# EAGLE design SK_1.0v (EAGLE 7.5.0)
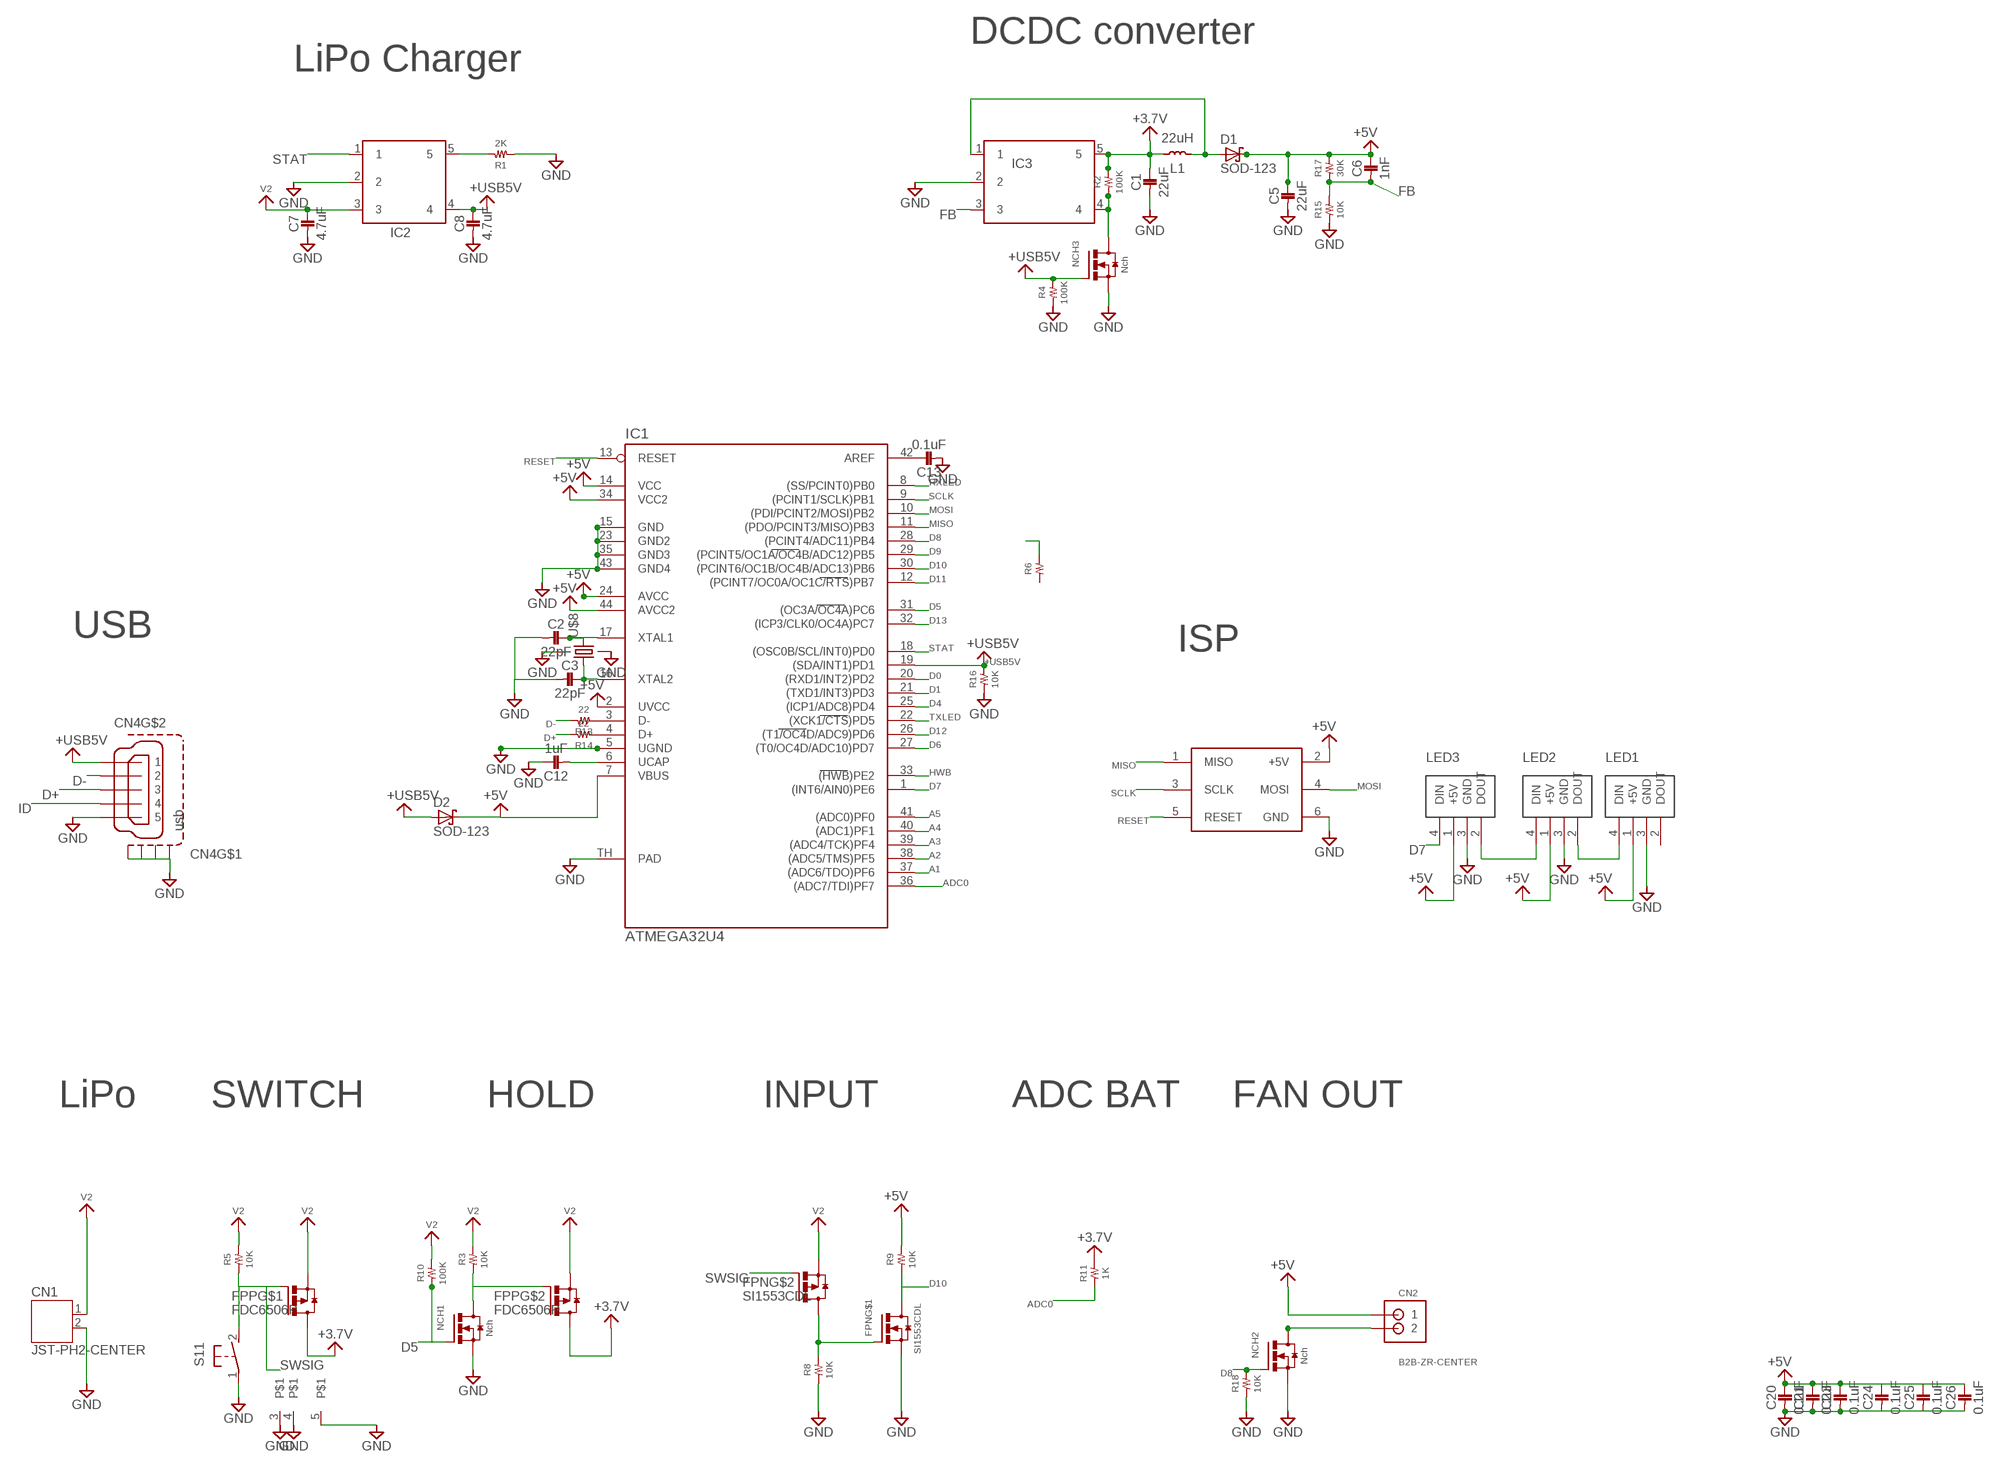
[diagram p0: schematic, sheet 1]

## Parts
C1  22uF  1608  [1608]
C2  22pF  1005  [1005]
C3  22pF  1005  [1005]
C5  22uF  1608  [1608]
C6  1nF  1005  [1005]
C7  4.7uF  1005  [1005]
C8  4.7uF  1005  [1005]
C12  1uF  1005  [1005]
C13  0.1uF  1005  [1005]
C20  0.1uF  1608  [1608]
C21  0.1uF  1608  [1608]
C23  0.1uF  1608  [1608]
C24  0.1uF  1005  [1005]
C25  0.1uF  1005  [1005]
C26  0.1uF  1005  [1005]
CN1  JST-PH2-CENTER  [JST-PH2-CENTER]
CN2  B2B-ZR-CENTER  [B2B-ZR-CENTER]
CN4  usb  MICRO-USB-SHIELD-ZX62R-B-5P  [ZX62R-B-5P]
D1  SOD-123  [SOD_123]
D2  SOD-123  [SOD_123]
FPN  SI1553CDL  [SOT363]
FPP  FDC6506P  [SOT23-6]
IC1  ATMEGA32U4  [QFN-44-7X7]
IC2  MCP73831  [SOT23-5L]
IC3  LM2735  [SOT23-5L]
L1  22uH  D63  [TOKO]
LED1  NEO_FLAT  [NEO_FLAT]
LED2  NEO_FLAT  [NEO_FLAT]
LED3  NEO_FLAT  [NEO_FLAT]
NCH1  Nch  CHIP_FET  [SOT23]
NCH2  Nch  CHIP_FET  [SOT23]
NCH3  Nch  CHIP_FET  [SOT23]
R1  2K  RESISTOR_1005  [1005]
R2  100K  RESISTOR_1005  [1005]
R3  10K  RESISTOR_1005  [1005]
R4  100K  RESISTOR_1005  [1005]
R5  10K  RESISTOR_1005  [1005]
R6  RESISTOR__SMD  [1608]
R8  10K  RESISTOR_1005  [1005]
R9  10K  RESISTOR_1005  [1005]
R10  100K  RESISTOR_1005  [1005]
R11  1K  RESISTOR_1005  [1005]
R13  22  RESISTOR_1005  [1005]
R14  22  RESISTOR_1005  [1005]
R15  10K  RESISTOR_1005  [1005]
R16  10K  RESISTOR_1005  [1005]
R17  30K  RESISTOR_1005  [1005]
R18  10K  RESISTOR_1005  [1005]
S1  31-XX  [B3F-31XX]
U$3  ICSP  [ICSP]
U$8  FA-238  [FA-238]

## Nets
+3.7V: C1.P$1 FPP.4(D) FPP.6(D) IC3.5 L1.1 R2.2 R11.2
+5V: C5.P$1 C6.1 C20.P$1 C21.P$1 C23.P$1 C24.1 C25.1 C26.1 CN2.1 D1.C D2.C IC1.2(UVCC) IC1.7(VBUS) IC1.14(VCC) IC1.24(AVCC) IC1.34(VCC2) IC1.44(AVCC2) LED1.1(+5V) LED2.1(+5V) LED3.1(+5V) R9.2 R17.2 U$3.2(+5V)
+USB5V: C8.1 CN4.1 D2.A IC1.19((SDA/INT1)PD1) IC2.4 NCH3.1(G) R4.2 R16.2
A1: IC1.37((ADC6/TDO)PF6)
A2: IC1.38((ADC5/TMS)PF5)
A3: IC1.39((ADC4/TCK)PF4)
A4: IC1.40((ADC1)PF1)
A5: IC1.41((ADC0)PF0)
ADC0: IC1.36((ADC7/TDI)PF7) R11.1
D0: IC1.20((RXD1/INT2)PD2)
D1: IC1.21((TXD1/INT3)PD3)
D4: IC1.25((ICP1/ADC8)PD4)
D5: IC1.31((OC3A/OC4A)PC6) NCH1.1(G) R10.1
D6: IC1.27((T0/OC4D/ADC10)PD7)
D7: IC1.1((INT6/AIN0)PE6) LED3.4(DIN)
D8: IC1.28((PCINT4/ADC11)PB4) NCH2.1(G) R18.2
D9: IC1.29((PCINT5/OC1A/OC4B/ADC12)PB5) R6.2
D10: FPN.6(D) IC1.30((PCINT6/OC1B/OC4B/ADC13)PB6) R9.1
D11: IC1.12((PCINT7/OC0A/OC1C/RTS)PB7)
D12: IC1.26((T1/OC4D/ADC9)PD6)
D13: IC1.32((ICP3/CLK0/OC4A)PC7)
D+: CN4.3 R14.2
D-: CN4.2 R13.2
DL: D1.A IC3.1 L1.2
FB: C6.2 IC3.3 R15.2 R17.1
GND: C1.P$2 C2.2 C3.2 C5.P$2 C7.2 C8.2 C12.1 C13.2 C20.P$2 C21.P$2 C23.P$2 C24.2 C25.2 C26.2 CN1.2 CN4.5 CN4.M1(S1) CN4.M2(S2) CN4.M3(S3) CN4.M4(S4) FPN.1(S) IC1.5(UGND) IC1.15(GND) IC1.23(GND2) IC1.35(GND3) IC1.43(GND4) IC1.TH(PAD) IC2.2 IC3.2 LED1.3(GND) LED2.3(GND) LED3.3(GND) NCH1.2(S) NCH2.2(S) NCH3.2(S) R1.1 R4.1 R8.1 R15.1 R16.1 R18.1 S1.1(1:P) S1.3 S1.4 S1.5 U$3.6(GND) U$8.2 U$8.4
HWB: IC1.33((HWB)PE2)
ID: CN4.4
MISO: IC1.11((PDO/PCINT3/MISO)PB3) U$3.1(MISO)
MOSI: IC1.10((PDI/PCINT2/MOSI)PB2) U$3.4(MOSI)
N$1: CN2.2 NCH2.3(D)
N$2: IC2.5 R1.2
N$3: IC3.4 NCH3.3(D) R2.1
N$6: FPP.3(G) NCH1.3(D) R3.1
N$7: C3.1 IC1.16(XTAL2) U$8.1
N$8: IC1.3(D-) R13.1
N$9: C13.1 IC1.42(AREF)
N$10: C2.1 IC1.17(XTAL1) U$8.3
N$14: IC1.4(D+) R14.1
N$18: C12.2 IC1.6(UCAP)
RESET: IC1.13(RESET) U$3.5(RESET)
RXLED: IC1.8((SS/PCINT0)PB0)
SCLK: IC1.9((PCINT1/SCLK)PB1) U$3.3(SCLK)
SIG: FPN.2(G) FPN.3(D) R8.2
SIG1: LED2.4(DIN) LED3.2(DOUT)
SIG2: LED1.4(DIN) LED2.2(DOUT)
STAT: IC1.18((OSC0B/SCL/INT0)PD0) IC2.1
SWSIG: FPN.5(G) FPP.1(G) R5.1 S1.2(1:S)
TXLED: IC1.22((XCK1/CTS)PD5)
V2 [POWER]: C7.1 CN1.1 FPN.4(S) FPP.2(S) FPP.5(S) IC2.3 R3.2 R5.2 R10.2
Unconnected: LED1.2(DOUT) R6.1

## Notes on the sheet
- DCDC converter
- LiPo Charger
- USB
- ISP
- LiPo | SWITCH | HOLD | INPUT | ADC BAT | FAN OUT

## Library data of the parts
C1 C5 C20 C21 C23 = 02_C:1608
C2 C3 C6-C8 C12 C13 C24-C26 = 02_C:1005
CN1 = jst-ph (1):JST-PH2-CENTER
CN2 = jst:B2B-ZR-CENTER
CN4 = con-hirose1:MICRO-USB-SHIELD-: Hirose Micro USB Connector ZX62R-B-5P: Micro B, reverse (top mount) shell SMT Supplier: DigiKey H11574CT-ND Source: http://www.hirose.co.jp/cataloge_hp/e24200011.pdf
D1 D2 = 15_DIODE:SOD-123
FPN = 06_FET:SI1553CDL
FPP = 06_FET:FDC6506P
IC1 = 04_IC:ATMEGA32U4
IC2 = 04_IC:MCP73831
IC3 = 04_IC:LM2735
L1 = 03_L:D63
LED1-LED3 = 10_LED:NEO_FLAT
NCH1-NCH3 = 06_FET:CHIP_FET
R1-R5 R8-R11 R13-R18 = 01_R:RESISTOR_1005
R6 = 01_R:RESISTOR__SMD
S1 = 09_1_switch:31-XX: OMRON SWITCH
U$3 = 08_CONECTOR:ICSP
U$8 = 09_2_CRYSTAL:FA-238

## Board
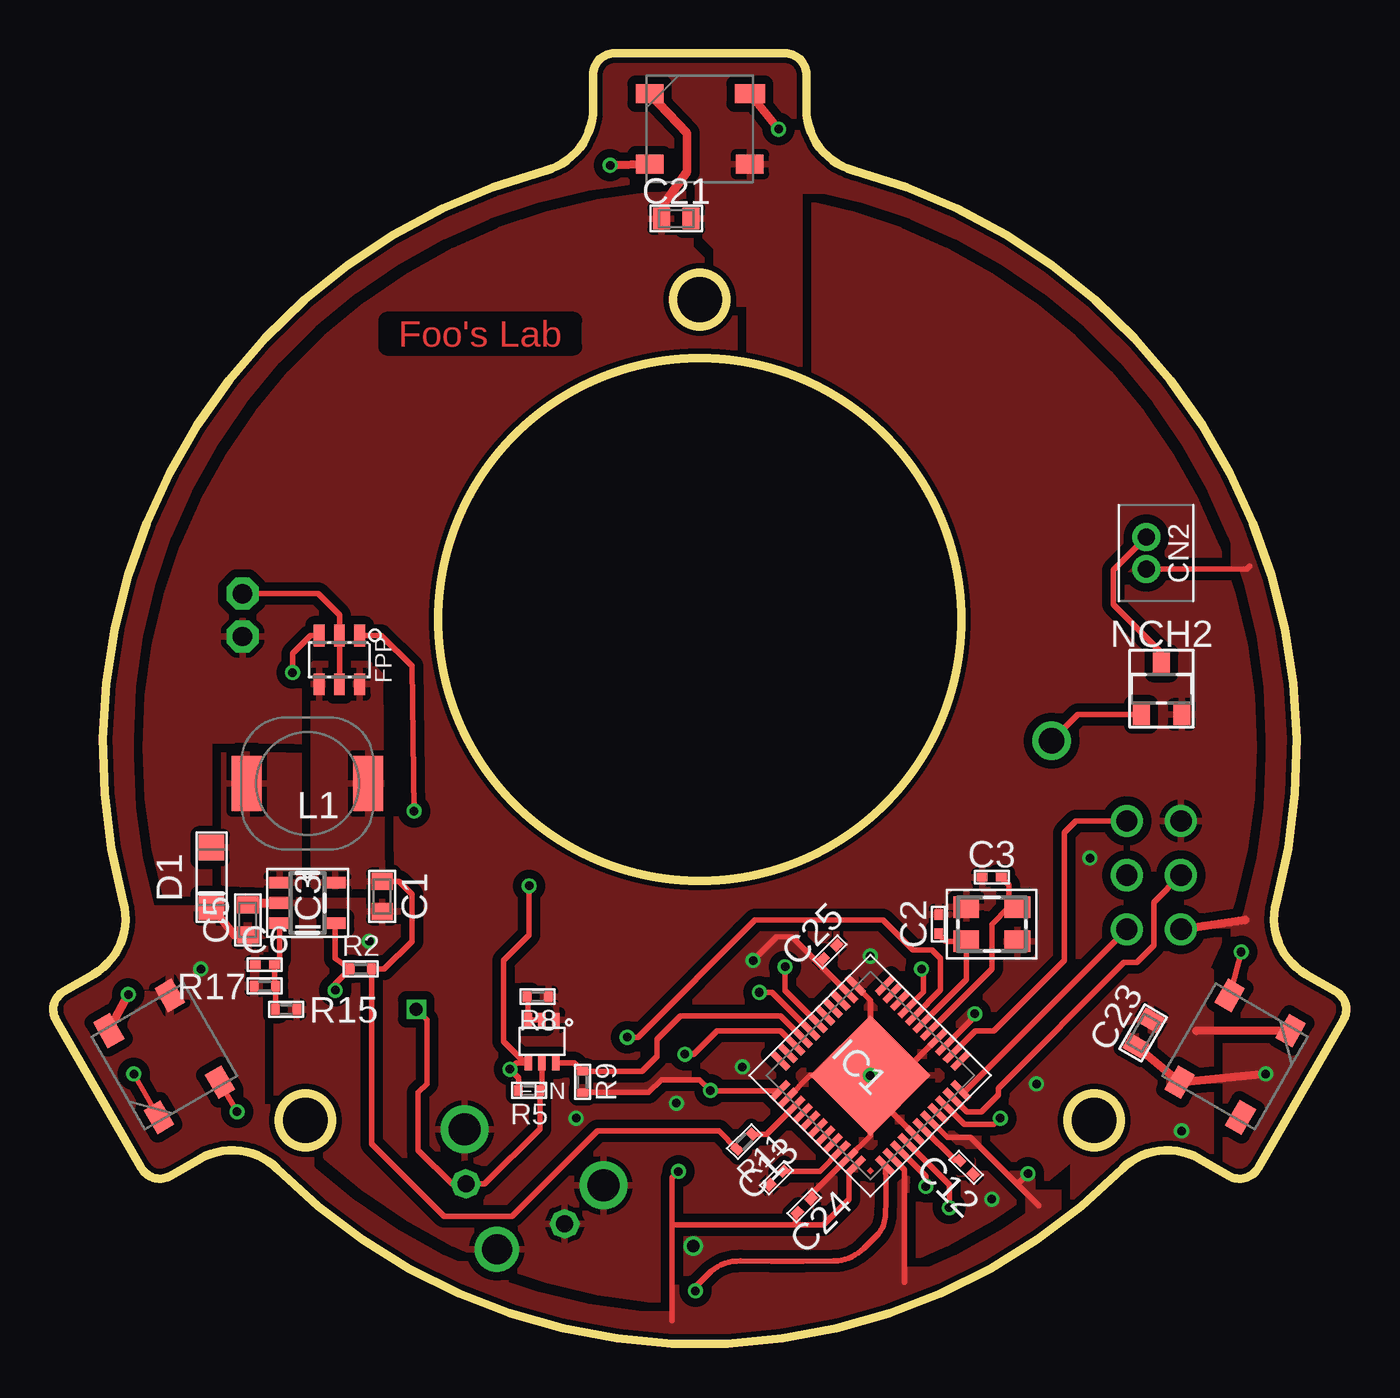
[diagram p1: board, top side]
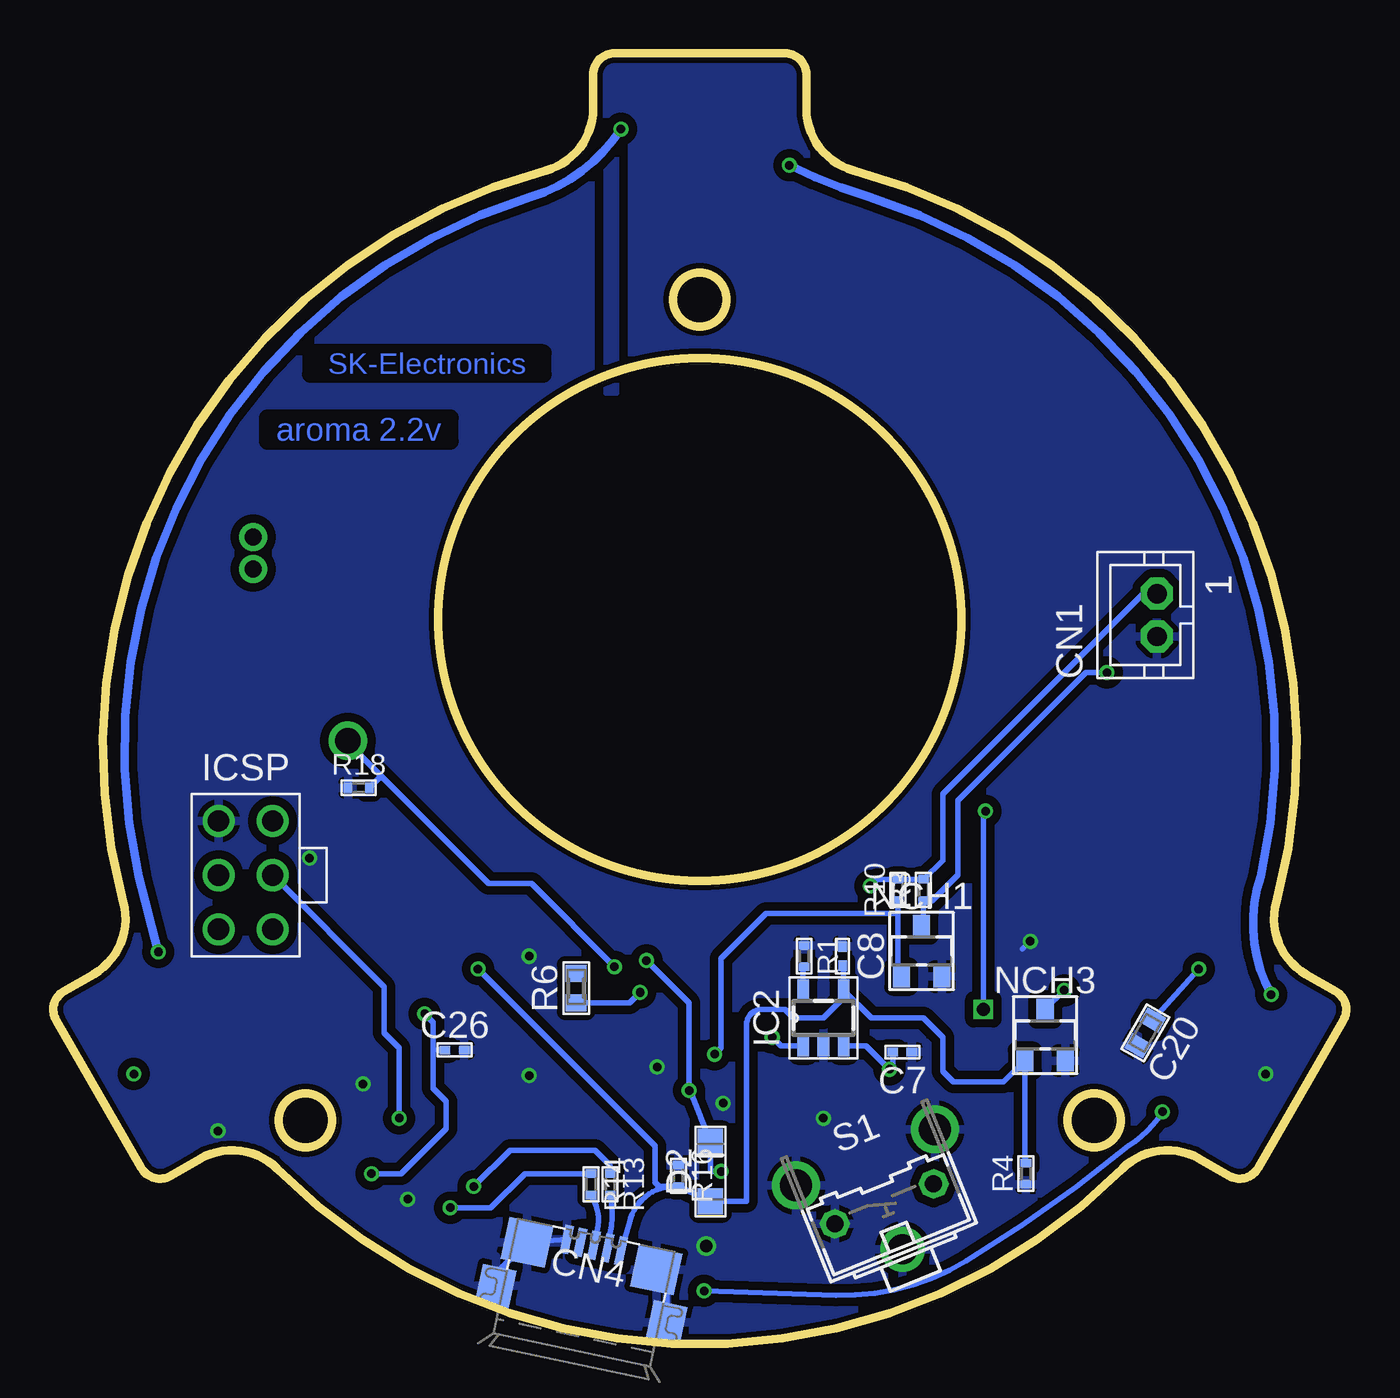
[diagram p2: board, bottom side, seen from below]

Size 60.65 x 60.52 mm. Coordinates in mm from the lower left corner, seen from the top.
Outline: 0.5,16.53 arc90 0.13,15.16 4.13,8.23 arc90 5.5,7.87 6.89,8.67 arc-75 10.51,8.19 arc90 50.14,8.19 arc-75 53.76,8.67 55.15,7.87 arc90 56.51,8.23 60.51,15.16 arc90 60.15,16.53 58.76,17.33 arc-75 57.36,20.7 arc90 37.55,55.02 arc-75 35.32,57.92 35.32,59.52 arc90 34.32,60.52 26.32,60.52 arc90 25.32,59.52 25.32,57.92 arc-75 23.1,55.02 arc90 3.28,20.7 arc-75 1.89,17.33 0.5,16.53
Outline: circle at 30.32,48.97 radius 1.25
Outline: circle at 30.32,33.97 radius 12.25
Outline: circle at 48.82,10.47 radius 1.25
Outline: circle at 11.82,10.47 radius 1.25
Copper layers (1*16): Top 0.035mm / dielectric 1.5mm / Bottom 0.035mm
Design rules "LPKF": minimum track width 6mil, minimum drill 12mil, track to track 0.4mm, track to pad 0.4mm, pad to pad 0.4mm, via to via 0.4mm, smd to smd 0.4mm, copper to edge 10mil, drill to drill 0.4mm, minimum pad ring 10mil, minimum via ring 6mil, stop-mask expansion 2mil, vias tented up to drill 100mil, thermal gap 10mil
tKeepout: area 9.6,8.2 to 14.1,12.7; area 46.6,8.2 to 51.1,12.7; 28 lines

### Footprints (pad centres in the part's own frame; a part is rotated, then mirrored left to right if it is on the bottom)
1608 = smd 0.8 x 1: P$1 -0.7,0; P$2 0.7,0
1005 = smd 0.5 x 0.4: 1 -0.45,0; 2 0.45,0
JST-PH2-CENTER = drill 0.9 pad 1.5 octagon: 1 1,-0.55; 2 -1,-0.55
B2B-ZR-CENTER = drill 0.8 pad 1.1: 1 -0.75,0.45; 2 0.75,0.45
ZX62R-B-5P = smd 1.35 x 0.4: 1 2.875,-1.3; 2 2.875,-0.65; 3 2.875,0; 4 2.875,0.65; 5 2.875,1.3 | smd 1.8 x 1.6: M1 0.05,-4.1; M2 0.05,4.1 | smd 2 x 2.1: M3 2.35,3.1; M4 2.35,-3.1
SOD_123 = smd 1.2 x 1.2: A -1.4,0; C 1.4,0
SOT363 = smd 0.35 x 0.7: 1 -0.65,-1; 2 0,-1; 3 0.65,-1; 4 0.65,1; 5 0,1; 6 -0.65,1
SOT23-6 = smd 0.508 x 1.016: 1 -0.95,-1.143; 2 0,-1.143; 3 0.95,-1.143; 4 0.95,1.143; 5 0,1.143; 6 -0.95,1.143
QFN-44-7X7 = smd 1.1 x 0.3: 1 -3.5,2.5; 2 -3.5,2; 3 -3.5,1.5; 4 -3.5,1; 5 -3.5,0.5; 6 -3.5,0; 7 -3.5,-0.5; 8 -3.5,-1; 9 -3.5,-1.5; 10 -3.5,-2; 11 -3.5,-2.5; 23 3.5,-2.5; 24 3.5,-2; 25 3.5,-1.5; 26 3.5,-1; 27 3.5,-0.5; 28 3.5,0; 29 3.5,0.5; 30 3.5,1; 31 3.5,1.5; 32 3.5,2; 33 3.5,2.5 | smd 0.3 x 1.1: 12 -2.5,-3.5; 13 -2,-3.5; 14 -1.5,-3.5; 15 -1,-3.5; 16 -0.5,-3.5; 17 0,-3.5; 18 0.5,-3.5; 19 1,-3.5; 20 1.5,-3.5; 21 2,-3.5; 22 2.5,-3.5; 34 2.5,3.5; 35 2,3.5; 36 1.5,3.5; 37 1,3.5; 38 0.5,3.5; 39 0,3.5; 40 -0.5,3.5; 41 -1,3.5; 42 -1.5,3.5; 43 -2,3.5; 44 -2.5,3.5 | smd 4 x 4: TH 0,0
SOT23-5L = smd 0.55 x 1: 1 -0.95,-1.3; 2 0,-1.3; 3 0.95,-1.3; 4 0.95,1.3; 5 -0.95,1.3
TOKO = smd 1.4 x 2.6: 1 -2.85,0; 2 2.85,0
NEO_FLAT = smd 1.3 x 0.9: 1 -2.35,1.65; 3 2.35,-1.65; 4 2.35,1.65 | smd 1.4 x 0.9: 2 -2.35,-1.65
SOT23 = smd 0.8 x 1: 1 -0.95,-1.2; 2 0.95,-1.2; 3 0,1.2
1005' = smd 0.4 x 0.5: 1 -0.5,0; 2 0.5,0
1608' = smd 0.8 x 1: 1 -0.7,0; 2 0.7,0
B3F-31XX = drill 0.8 octagon: 1 -2.5,-1.1; 2 2.5,-1.1 | drill 1.5 pad 2.159: 3 -3.505,1.245; 4 3.505,1.245 | drill 1.4: 5 0,-3.4
ICSP = drill 1 pad 1.5: 1 -1.27,2.54; 2 1.27,2.54; 3 -1.27,0; 4 1.27,0; 5 -1.27,-2.54; 6 1.27,-2.54
FA-238 = smd 1.2 x 1: 1 -1.2,-0.8; 2 1.2,-0.8; 3 1.2,0.8; 4 -1.2,0.8

### Placement (x,y rotation side)
C1  15.42,20.97 270 top
C2  41.52,19.67 90 top
C3  44.02,21.87 180 top
C5  9.12,19.87 90 top
C6  9.92,17.77 0 top
C7  20.82,13.67 0 bottom
C8  23.62,18.17 90 bottom
C12  42.82,8.27 135 top
C13  33.92,7.77 225 top
C20  9.42,14.57 240 bottom
C21  29.22,52.77 180 top
C23  51.12,14.57 60 top
C24  35.22,6.47 45 top
C25  36.42,18.37 45 top
C26  41.82,13.77 0 bottom
CN1  9.42,34.17 90 bottom
CN2  51.72,37.07 90 top
CN4  35.88,1.8 78 bottom
D1  7.42,21.87 270 top
D2  29.82,8.07 90 bottom
FPN  22.92,14.17 180 top
FPP  13.42,32.07 180 top
IC1  38.32,12.57 135 top
IC2  24.52,15.27 0 bottom
IC3  11.92,20.67 270 top
L1  11.92,26.27 180 top
LED1  55.44,13.47 60 top
LED2  30.32,56.97 180 top
LED3  5.21,13.47 300 top
NCH1  19.92,18.41 0 bottom
NCH2  51.98,30.71 0 top
NCH3  14.12,14.47 0 bottom
R1  2K  [1005']  25.42,18.17 270 bottom
R2  100K  [1005']  14.42,17.57 0 top
R3  10K  [1005']  19.82,21.27 90 bottom
R4  100K  [1005']  15.02,7.97 90 bottom
R5  10K  [1005']  22.32,11.87 180 top
R6  [1608']  36.12,16.67 270 bottom
R8  10K  [1005']  22.72,16.27 180 top
R9  10K  [1005']  24.82,12.27 270 top
R10  100K  [1005']  21.02,21.27 90 bottom
R11  1K  [1005']  32.42,9.47 225 top
R13  22  [1005']  34.52,7.47 270 bottom
R14  22  [1005']  35.42,7.47 270 bottom
R15  10K  [1005']  10.92,15.67 180 top
R16  10K  [1005']  31.32,7.87 270 bottom
R17  30K  [1005']  9.92,16.77 180 top
R18  10K  [1005']  46.32,26.07 0 bottom
S1  22.08,7.57 22 bottom
U$3  51.62,21.97 180 bottom
U$8  44.02,19.67 180 top

### Tracks (layer width: path | path; a pad name or v marks a point on that pad's centre or on a via)
+3.7V
  Top 0.25: C1.P$1 16.22,21.67 16.82,21.07 16.82,18.87 15.52,17.57 R2.2 14.92,9.37 18.32,5.97 21.52,5.97 25.52,9.97 31.22,9.97 R11.2
  pour Top (rank 2): 15.32,31.17 15.42,21.47 12.22,21.47 12.22,31.87 14.82,31.87 15.32,31.37
+5V  (via drill 0.4)
  Top 0.25: IC1.2 39.92,8.14 39.92,2.87 | IC1.7 41.93,9.67 43.02,9.67 45.27,7.42 | IC1.34 v30.83,11.86 v30.82,11.87 30.32,12.37 28.52,12.37 27.92,11.77 R9.2 | IC1.24 35.79,17.93 | 35.79,17.93 34.65,19.07 33.92,19.07 v32.82,17.97 | CN2.1 55.97,36.32 56.12,36.47 | IC1.14 43.22,15.35 v43.22,15.47 | v45.72,7.97 45.27,7.52 45.27,7.42 | v29.32,8.07 29.02,7.77 29.02,5.57 | 29.02,5.57 29.02,1.07 | 34.82,5.57 36.12,5.57 37.32,6.77 37.32,8.03 IC1.44 | 34.82,5.57 29.02,5.57 | C24.1 34.82,6.07 34.82,5.57 | C25.1 35.99,17.93 35.79,17.93 | 45.27,7.42 46.22,6.47 | v6.92,17.57 arc186 6.72,17.37
  Top 0.4: C5.P$1 8.48,19.17 D1.C | v56.87,12.65 LED1.1 C23.P$1 | U$3.2 55.92,19.87
  Bottom 0.25: v32.82,17.97 30.82,15.97 v30.82,11.87 30.78,11.87 D2.C 29.82,8.07 v29.32,8.07 | v43.22,15.47 42.82,15.07 42.82,13.77 | v45.72,7.97 44.32,7.97 42.22,10.07 42.22,11.37 42.82,11.97 42.82,13.77 | C26.1 42.82,13.77 | C20.P$1 v6.92,17.57
  pour Top (rank 6): -4.68,-1.03 63.32,-1.03 63.32,65.97 -4.68,65.97
  pour Top (rank 4): 4.22,20.37 8.52,20.37 9.72,19.17 9.72,9.97 9.62,9.87 4.22,9.87
  pour Top: 30.22,55.17 30.22,52.27 32.62,49.87 32.62,43.47 32.72,43.37 35.02,43.37 35.02,55.17
  pour Bottom: 34.22,56.07 34.22,44.57 34.72,44.57 34.72,56.07
+USB5V  (via drill 0.4)
  Top 0.25: IC1.19 40.82,16.48 40.82,17.37 40.72,17.47 v40.72,17.57
  Bottom 0.25: CN4.1 33.62,5.67 arc83 R16.2 | R16.2 D2.A 28.12,6.67 28.12,14.97 arc81 27.52,15.67 26.32,15.67 25.92,15.27 24.52,15.27 23.57,16.22 IC2.4 | v40.72,17.57 32.42,9.27 32.42,7.57 32.22,7.37 R16.2 | IC2.4 23.57,17.67 C8.1 | NCH3.1 15.07,8.77 R4.2 | NCH3.1 15.22,13.27 | IC2.4 22.27,15.27 19.82,15.27 18.92,14.37 18.92,12.77 18.42,12.27 16.07,12.27 NCH3.1
ADC0
  Top 0.25: IC1.36 33.45,9.82 R11.1
D5  (via drill 0.4)
  Top 0.25: 29.92,13.57 v29.62,13.57 30.02,13.57 31.12,14.67 34.1,14.67 IC1.31
  Bottom 0.25: NCH1.1 21.02,17.36 21.02,20.17 | 21.02,20.17 R10.1 | v29.62,13.57 29.32,13.87 29.32,18.07 27.22,20.17 21.02,20.17
D7  (via drill 0.4)
  Top 0.25: 39.03,7.98 IC1.1 arc-6 39.02,5.97 arc-42 38.62,5.07 38.02,4.47 arc-44 36.62,3.87 arc-3 32.22,3.87 arc46 30.72,3.27 30.12,2.67 v30.12,2.47 | LED3.4 v8.62,10.87
  Bottom 0.25: v30.12,2.47 23.92,2.27 arc-33 17.82,3.87 arc-8 10.22,9.27 arc-29 v8.62,10.87
D8  (via drill 0.4, 1.2)
  Top 0.25: IC1.28 34.32,16.57 v34.32,17.67 | v46.82,28.27 48.06,29.51 NCH2.1
  Bottom 0.25: v34.32,17.67 38.22,21.57 40.22,21.57 45.17,26.52 | 45.17,26.52 46.82,28.17 v46.82,28.27 | R18.2 45.37,26.52 45.17,26.52
D9  (via drill 0.4)
  Top 0.25: IC1.29 33.72,16.47 v33.12,16.47
  Bottom 0.25: R6.2 33.62,15.97 v33.12,16.47
D10
  Top 0.25: FPN.6 24.42,13.17 R9.1 27.62,12.77 28.32,13.47 28.32,14.27 29.42,15.37 34.11,15.37 IC1.30
D+
  Bottom 0.25: CN4.3 35.12,5.37 arc-45 R14.2
D-
  Bottom 0.25: CN4.2 34.52,5.17 arc-21 R13.2
DL
  pour Top (rank 3): 11.62,21.47 11.62,27.57 8.02,27.67 8.02,21.57
FB
  Top 0.25: IC3.3 10.62,18.02 C6.2 10.37,16.82 R17.1 R15.2
GND  (via drill 0.4, 0.6)
  Top 0.25: IC1.15 39.74,12.57 IC1.TH | IC1.23 38.32,16.11 IC1.TH | IC1.5 38.32,11.86 IC1.TH | IC1.35 35.49,12.57 IC1.TH | IC1.TH 38.32,9.74 IC1.43 35.57,6.99 C24.2 | LED3.3 v3.78,12.65
  Top 0.4: C5.P$2 9.22,20.67 IC3.2 | LED1.3 53.62,14.67 | LED2.3 29.72,56.77 29.72,54.97 28.72,53.57 C21.P$2
  Bottom 0.25: CN4.M2 39.88,3.29 CN4.M3 CN4.5 | CN4.M1 31.86,2.95 CN4.M4 | 15.18,18.51 v14.82,18.87
  other vias: 38.32,12.57 44.02,6.77 52.92,9.97 24.52,10.57 30.02,4.57 32.32,12.97 46.12,12.17 38.32,18.17 29.22,11.27 48.62,22.77
  pour Bottom (rank 6): -4.68,-1.03 -4.68,63.97 65.32,63.97 65.32,-1.03
  pour Top (rank 5): 30.32,53.97 arc90 4.32,27.97 arc90 30.32,1.97 arc90 56.32,27.97 arc90
  pour Top: 47.82,17.47 47.82,-6.03 54.32,-6.03 54.32,17.47
MISO
  Top 0.25: U$3.1 42.79,11.86 IC1.11
MOSI
  Top 0.25: U$3.4 51.62,20.7 51.62,18.67 50.82,17.87 50.22,17.87 44.32,11.97 44.32,11.67 43.52,10.87 42.85,10.87 IC1.10
N$1
  Top 0.25: NCH2.3 51.98,32.41 49.72,34.67 49.72,36.27 CN2.2
N$2
  Bottom 0.25: IC2.5 25.47,17.62 R1.2
N$3  (via drill 0.4)
  Top 0.25: IC3.4 13.22,18.07 R2.1 13.22,16.87 v13.22,16.57
  Bottom 0.25: NCH3.3 v13.22,16.57
N$6  (via drill 0.4)
  Top 0.25: FPP.3 12.07,33.21 11.22,32.37 v11.22,31.47
  Bottom 0.25: NCH1.3 19.82,19.71 R3.1 19.42,20.77 18.22,21.97 18.22,25.47 12.22,31.47 v11.22,31.47
N$7
  Top 0.25: IC1.16 44.02,17.56 44.02,19.67 44.82,20.47 | 44.82,20.47 U$8.1 | 44.82,20.47 44.82,21.52 C3.1
N$8  (via drill 0.4)
  Top 0.25: v40.92,7.37 40.92,7.85 IC1.3
  Bottom 0.25: R13.1 34.52,8.37 35.22,9.07 39.22,9.07 v40.92,7.37
N$9
  Top 0.25: IC1.42 35.96,8.09 C13.1
N$10
  Top 0.25: IC1.17 42.82,17.07 U$8.3 41.87,18.87 C2.1
N$14  (via drill 0.4)
  Top 0.25: v42.02,6.37 42.02,7.46 IC1.4
  Bottom 0.25: R14.1 38.52,7.97 40.12,6.37 v42.02,6.37
N$18
  Top 0.25: C12.2 42.3,8.59 IC1.6
RESET
  Top 0.25: IC1.13 43.25,14.67 44.12,14.67 47.42,17.97 47.42,23.97 47.96,24.51 U$3.5
SCLK  (via drill 0.4)
  Top 0.25: v44.42,10.57 44.12,10.27 42.74,10.27 IC1.9
  Bottom 0.25: v44.42,10.57 44.42,13.87 45.12,14.57 45.12,16.74 U$3.3
SIG
  Top 0.25: FPN.2 FPN.3 22.27,16.22 R8.2
SIG1  (via drill 0.4)
  Top 0.4: LED3.2 v3.52,16.37 | v26.12,55.27 LED2.4
  Bottom 0.4: v3.52,16.37 arc47 4.01,21.91 arc-86 22.41,53.79 arc10 v26.12,55.27
SIG2  (via drill 0.4)
  Top 0.25: LED1.4 v55.72,18.37
  Top 0.4: v34.02,56.97 LED2.2
  Bottom 0.4: v55.72,18.37 arc1 56.63,21.91 arc86 38.23,53.79 arc-40 v34.02,56.97
STAT  (via drill 0.4)
  Top 0.25: IC1.18 41.62,16.58 41.62,18.07 41.22,18.47 40.32,18.47 38.92,19.87 32.92,19.87 27.42,14.37 v26.92,14.37
  Bottom 0.25: IC2.1 26.52,13.97 v26.92,14.37
SWSIG  (via drill 0.4, 0.6)
  Top 0.25: FPP.1 15.38,33.21 16.82,31.77 v16.92,24.97 | FPN.5 22.92,11.97 R5.1 22.82,10.07 20.24,7.49 S1.2 18.71,7.49 17.12,9.07 17.12,11.77 17.52,12.17 17.52,15.17 v17.02,15.67
  Bottom 0.25: v17.02,15.67 17.02,24.87 v16.92,24.97
V2  (via drill 0.4)
  Top 0.25: FPP.5 FPP.2 13.42,34.17 12.42,35.17 CN1.1 | v22.32,21.47 22.32,19.17 21.12,17.97 21.12,14.17 22.12,13.17 FPN.4 21.72,13.17 v21.42,12.87 21.82,12.47 R5.2
  Bottom 0.25: v22.32,21.47 22.02,21.77 R10.2 R3.2 18.92,22.67 18.92,25.77 9.52,35.17 CN1.1 | IC2.3 22.52,13.97 v21.42,12.87 21.27,13.02 C7.1

### Text on the board
Top: Foo's Lab
Bottom: SK-Electronics | aroma 2.2v